# EAGLE schematic Spgsregler (EAGLE 8.5.1)
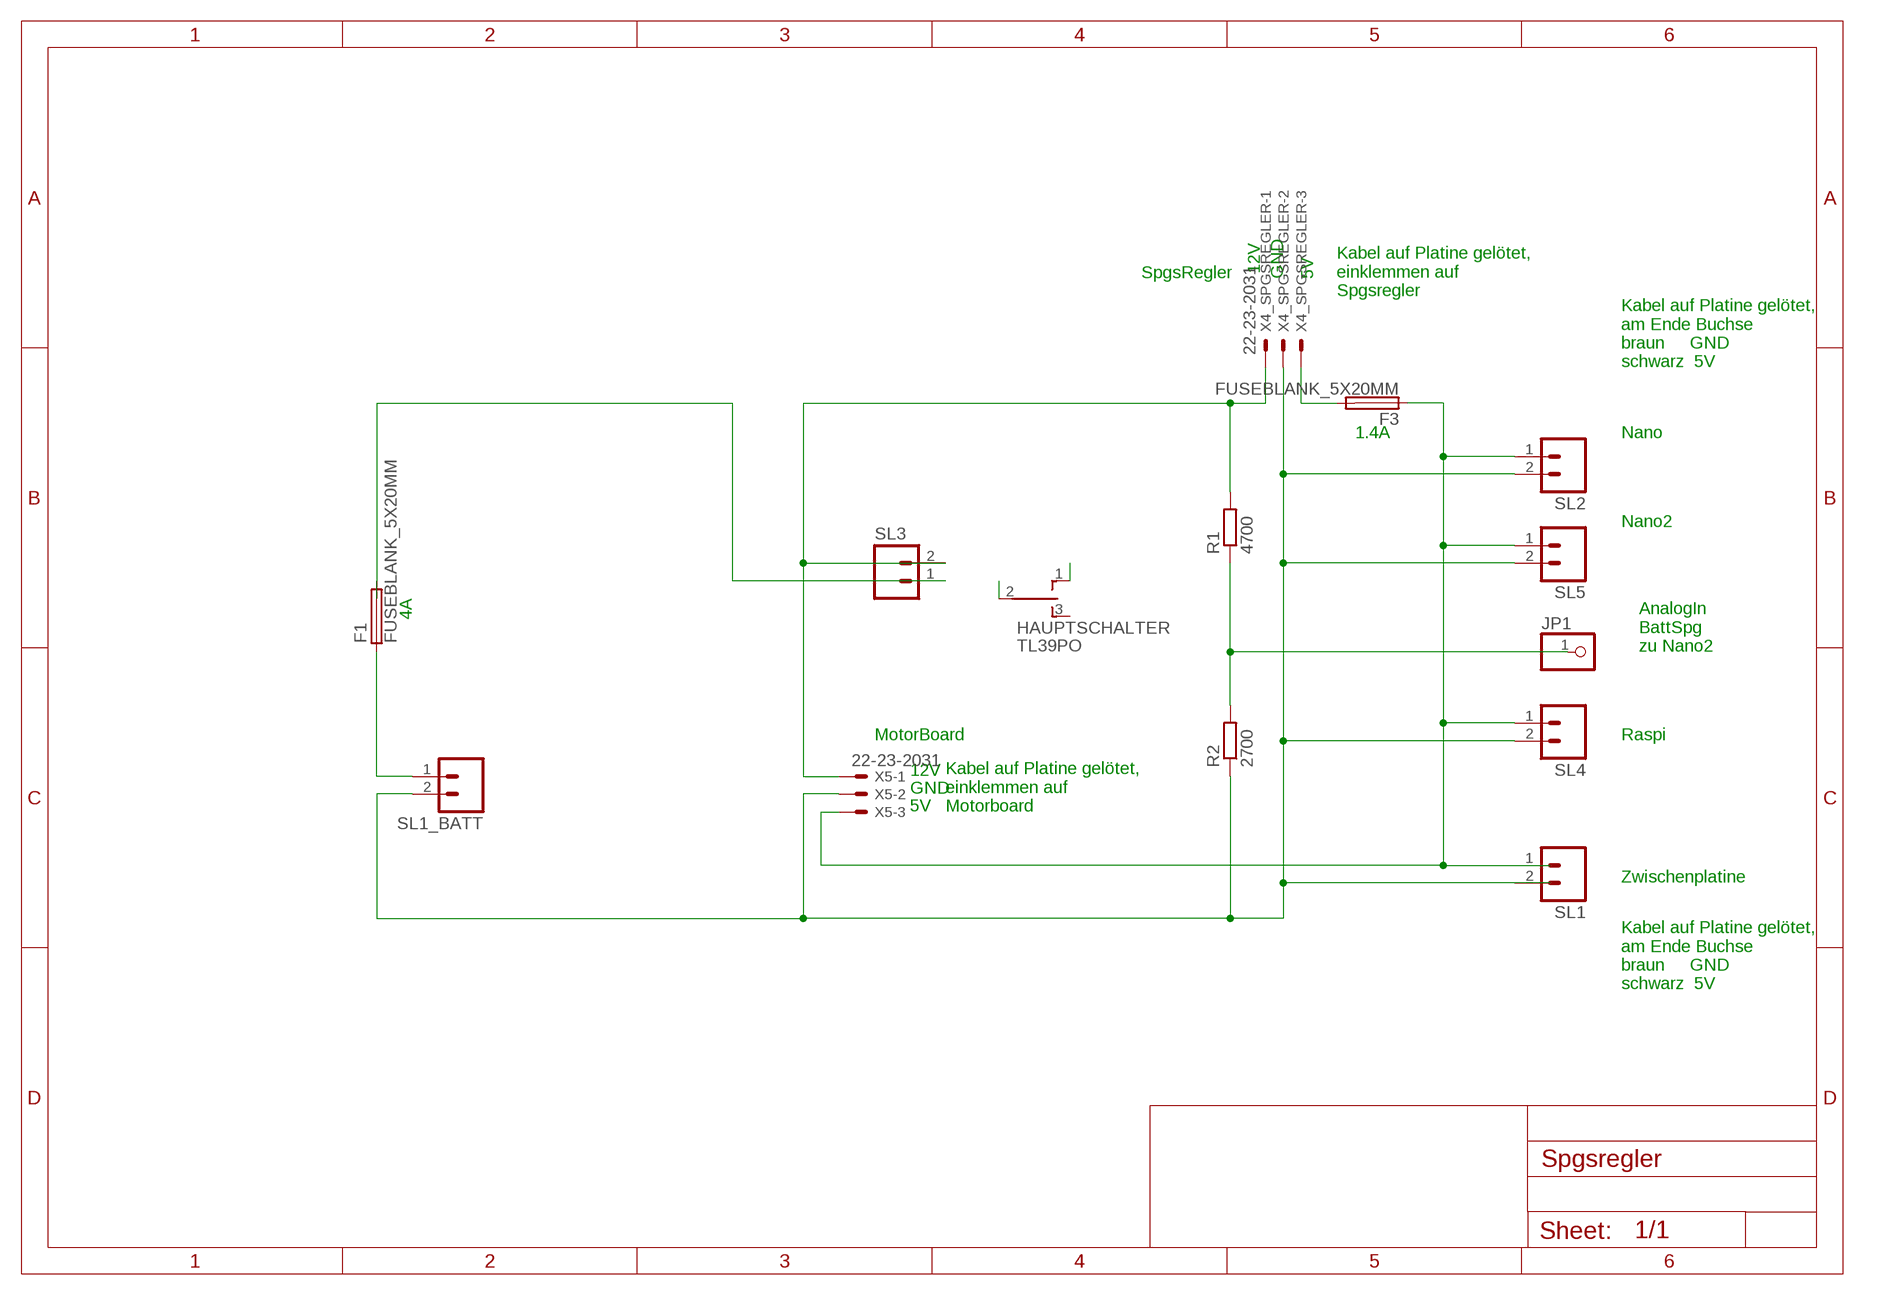
[diagram p0: schematic, sheet 1]

## Parts
F1  FUSEBLANK_5X20MM  [FUSE_HOLDER_5X20MM]
F3  FUSEBLANK_5X20MM  [FUSE_HOLDER_5X20MM]
HAUPTSCHALTER  TL39PO  [TL3XPO]
JP1  PINHD-1X1  [1X01]
R1  4700  R-EU_0207/10  [0207/10]
R2  2700  R-EU_0207/10  [0207/10]
SL1  M02  [02P]
SL1_BATT  M02  [02P]
SL2  M02  [02P]
SL3  M02  [02P]
SL4  M02  [02P]
SL5  M02  [02P]
X4_SPGSREGLER  22-23-2031  [22-23-2031]
X5  22-23-2031  [22-23-2031]

## Nets
N$1: F3.2 X4_SPGSREGLER.3
N$2: R2.1 SL1_BATT.2 SL2.2 SL4.2 SL5.2 X4_SPGSREGLER.2 X5.2
N$3: JP1.1 R1.1 R2.2
N$4: F1.1 SL1_BATT.1
N$5: R1.2 SL3.2 X4_SPGSREGLER.1 X5.1
N$6: F3.1 SL2.1 SL4.1 SL5.1 X5.3
N$8: F1.2 SL3.1
N$9: HAUPTSCHALTER.1(O)
N$10: HAUPTSCHALTER.2(P)
Unconnected: HAUPTSCHALTER.3(S) SL1.1 SL1.2

## Notes on the sheet
- 12V
- SpgsRegler | GND | 5V
- Kabel auf Platine gelötet,
  einklemmen auf
  Spgsregler
- Kabel auf Platine gelötet,
  am Ende Buchse
  braun     GND
  schwarz  5V
- 1.4A | Nano
- Nano2
- 4A
- AnalogIn
  BattSpg 
  zu Nano2
- MotorBoard | Raspi
- 12V
- GND
- 5V
- Kabel auf Platine gelötet,
  einklemmen auf
  Motorboard
- Zwischenplatine
- Kabel auf Platine gelötet,
  am Ende Buchse
  braun     GND
  schwarz  5V

## Library data of the parts
F1 F3 = fuse:FUSE: Fuse; OC_FARNELL: unknown; OC_NEWARK: unknown
HAUPTSCHALTER = switch:TL39PO: TINY SWITCH ON OFF ON Source: http://www2.produktinfo.conrad.com/datenblaetter/700000-724999/705152-da-01-de-Subminiaturschalter_TL_36YO.pdf
JP1 = pinhead:PINHD-1X1: PIN HEADER
R1 R2 = rcl:R-EU_: RESISTOR, European symbol
SL1 SL1_BATT SL2-SL5 = con-amp-quick:M02: AMP QUICK CONNECTOR; OC_FARNELL: unknown; OC_NEWARK: unknown
X4_SPGSREGLER X5 = con-molex:22-23-2031: .100" (2.54mm) Center Header - 3 Pin; MF: MOLEX; MPN: 22-23-2031; OC_FARNELL: 1462950; OC_NEWARK: 30C0862